# Altium schematic sheet MAINSSMB V1.4 .SchDoc
size A3; SheetNumber: 1; SheetTotal: 1
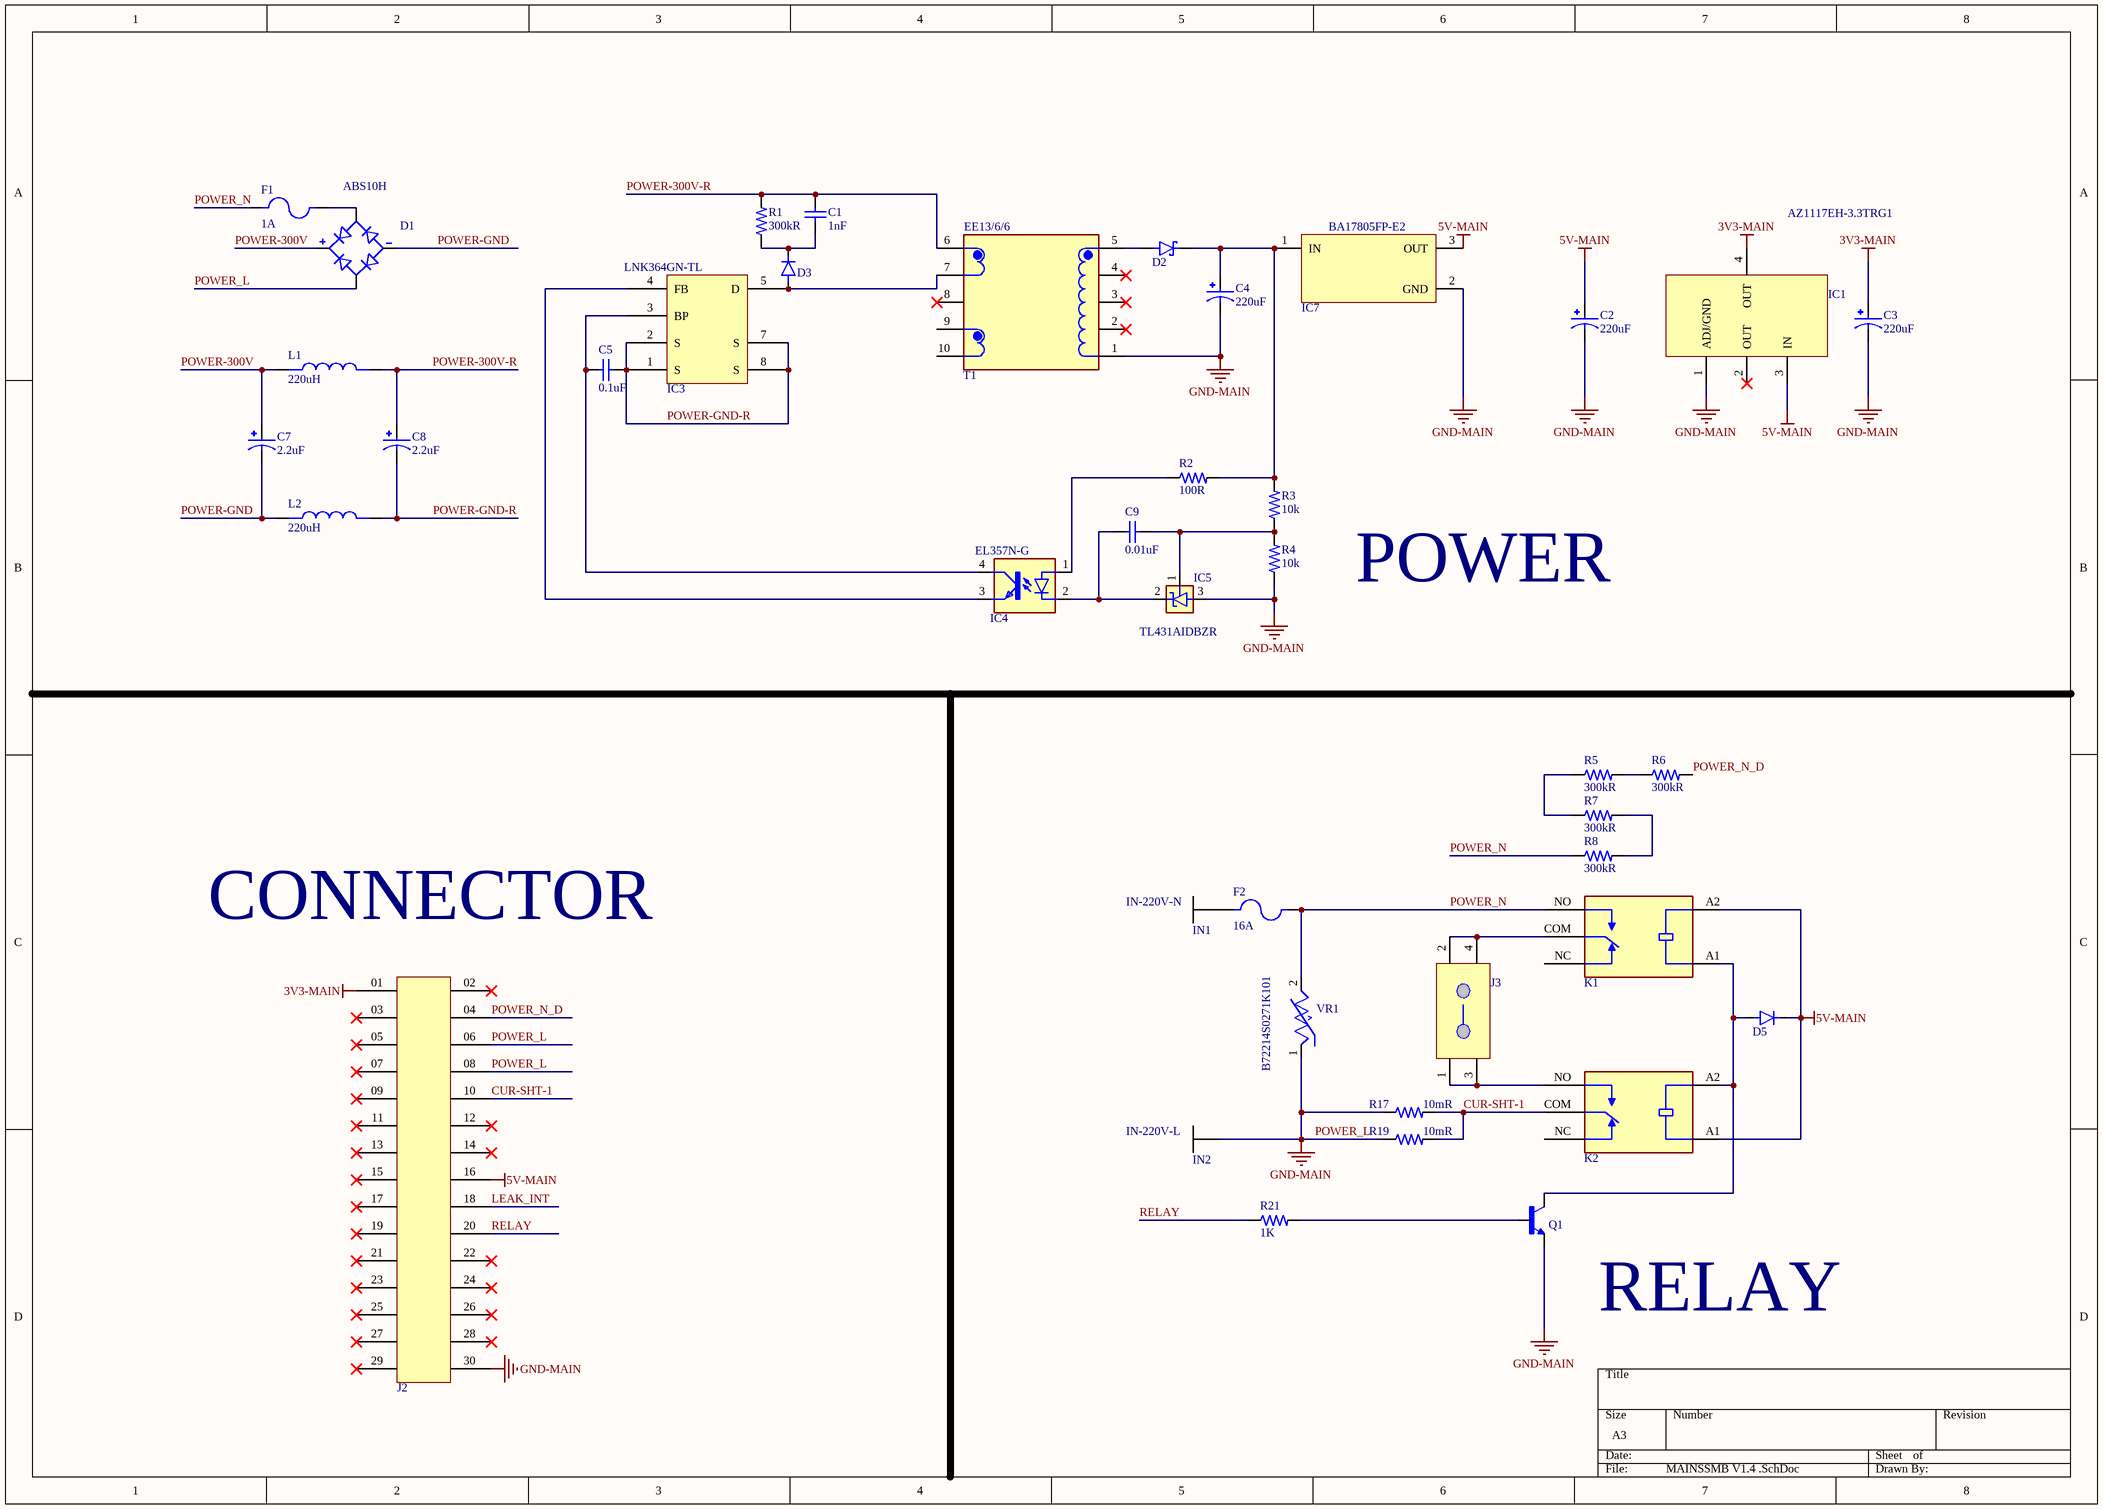
[diagram p0: MAINSSMB V1.4 .SchDoc]

## Parts
C1  value 1nF  [TH-CAP-HxLxW-5.5x4.0x2.5-TDKC]  (hidden comment: 1000 pF ±5% 50V Ceramic Capacitor C0G, NP0 Radial)
C2  value 220uF  [SMD-DxLxW-6.3x6.6x6.6-PEC]  (hidden comment: 220 µF 16 V Aluminum - Polymer Capacitors Radial, Can - SMD 22mOhm 1000 Hrs @ 125°C)
C3  value 220uF  [SMD-DxLxW-6.3x6.6x6.6-PEC]  (hidden comment: 220 µF 10 V Aluminum - Polymer Capacitors Radial, Can - SMD 20mOhm 2000 Hrs @ 105°C)
C4  value 220uF  [SMD-DxLxW-6.3x6.6x6.6-PEC]  (hidden comment: 220 µF 16 V Aluminum - Polymer Capacitors Radial, Can - SMD 22mOhm 1000 Hrs @ 125°C)
C5  value 0.1uF  [SMD-CAP-0603-YAGEO]  (hidden comment: 0.1 µF ±5% 50V Ceramic Capacitor X7R 0603 (1608 Metric))
C7  value 2.2uF  [TH-CAP-HxD-12.5x8.0-PEC]  (hidden comment: 2.2 µF 400 V Aluminum Electrolytic Capacitors Radial, Can 2000 Hrs @ 85°C)
C8  value 2.2uF  [TH-CAP-HxD-12.5x8.0-PEC]  (hidden comment: 2.2 µF 400 V Aluminum Electrolytic Capacitors Radial, Can 2000 Hrs @ 85°C)
C9  value 0.01uF  [SMD-CAP-0603-YAGEO]  (hidden comment: 10000 pF ±5% 25V Ceramic Capacitor X7R 0603 (1608 Metric))
D1  Manufacturer Part Number: ABS10H  [DIODE-SMD-4-TSC]  (hidden comment: Bridge Rectifier Single Phase Standard 1 kV Surface Mount ABS)
D2  Diode 40 V 3A Surface Mount DO-214AC (SMA)  [SMD-DO-214AC-214-CT]  (value not drawn)
D3  Diode 1000 V 1A Surface Mount SOD-123FL  [SOD-123FL-SMCDS]  (value not drawn)
D5  Diode 1000 V 1A Surface Mount SOD-123FL  [SOD-123FL-SMCDS]  (value not drawn)
F1  value 1A  [FUSE-HxLxW-8.0x8.5x4.0-LI]  (hidden comment: 1 A 300 V AC DC Fuse Board Mount (Cartridge Style Excluded) Through Hole Radial, Box)
F2  value 16A  [FUSE-3.6mmx10mm-AXIAL]  (hidden comment: FUSE; 16A; 0031.8211_1)
IC1  MP: AZ1117EH-3.3TRG1  [SOT-223-3-DI]  (hidden comment: Linear Voltage Regulator IC Positive Fixed 1 Output 1A SOT-223-3)
IC3  Converter Offline Flyback Topology 132kHz SMD-8B  [SMD-8B-PI]  (value not drawn)
IC4  Manufacturer Part Number: EL357N-G  [SOP-4]  (hidden comment: Optoisolator Transistor Output 3750Vrms 1 Channel 4-SOP (2.54mm))
IC5  Manufacturer Part Number: TL431AIDBZR  [SOT-23-3-DS]  (hidden comment: Shunt Voltage Reference IC Adjustable 2.495V 36 VV ±1% 100 mA SOT-23-3)
IC7  Manufacturer Part Number: BA17805FP-E2  [TO252-3-RS]  (hidden comment: Linear Voltage Regulator IC Positive Fixed 1 Output 1A TO-252)
IN1  INPUT  [INPUT-2.0x3.5]  (value not drawn)
IN2  INPUT  [INPUT-2.0x3.5]  (value not drawn)
J2  30 Position Elevated Socket Connector 0.100" (2.54mm) Through Hole Gold  [HEADER-2.54-15x2-N3D]  (value not drawn)
J3  Connector Header Through Hole 4 position 0.100" (2.54mm)  [SOCKET-SINGLE-WEV1081H]  (value not drawn)
K1  JQ1P-5V-F  [RELAY-JQ1P-10A-HxLxW-15.6x20.5x10.0-PEW]  (value not drawn)
K2  JQ1P-5V-F  [RELAY-JQ1P-10A-HxLxW-15.6x20.5x10.0-PEW]  (value not drawn)
L1  value 220uH  [SMD-HxLxW-1.8x4.0x4.0-ALLC]  (hidden comment: 220 µH Shielded Drum Core, Wirewound Inductor 250 mA 3.84Ohm Max Nonstandard)
L2  value 220uH  [SMD-HxLxW-1.8x4.0x4.0-ALLC]  (hidden comment: 220 µH Shielded Drum Core, Wirewound Inductor 250 mA 3.84Ohm Max Nonstandard)
Q1  Bipolar (BJT) Transistor NPN 45 V 500 mA 100MHz 300 mW Surface Mount SOT-23-3 (TO-236)  [SOT-23-3-ONSEMI]  (value not drawn)
R1  value 300kR  [SMD-RES-1206-RS]  (hidden comment: 300 kOhms ±1% 0.5W, 1/2W Chip Resistor 1206 (3216 Metric) Automotive AEC-Q200, Pulse Withstanding Thick Film)
R2  value 100R  [SMD-RES-0603-RS]  (hidden comment: 100 Ohms ±1% 0.1W, 1/10W Chip Resistor 0603 (1608 Metric) Automotive AEC-Q200, High Voltage Thick Film)
R3  value 10k  [SMD-RES-0603-SEI]  (hidden comment: 10 kOhms ±1% 0.25W, 1/4W Chip Resistor 0603 (1608 Metric) Automotive AEC-Q200, Pulse Withstanding Thick Film)
R4  value 10k  [SMD-RES-0603-SEI]  (hidden comment: 10 kOhms ±1% 0.25W, 1/4W Chip Resistor 0603 (1608 Metric) Automotive AEC-Q200, Pulse Withstanding Thick Film)
R5  value 300kR  [SMD-RES-0603-RS]  (hidden comment: 300 kOhms ±1% 0.1W, 1/10W Chip Resistor 0603 (1608 Metric) Automotive AEC-Q200, High Voltage Thick Film)
R6  value 300kR  [SMD-RES-0603-RS]  (hidden comment: 300 kOhms ±1% 0.1W, 1/10W Chip Resistor 0603 (1608 Metric) Automotive AEC-Q200, High Voltage Thick Film)
R7  value 300kR  [SMD-RES-0603-RS]  (hidden comment: 300 kOhms ±1% 0.1W, 1/10W Chip Resistor 0603 (1608 Metric) Automotive AEC-Q200, High Voltage Thick Film)
R8  value 300kR  [SMD-RES-0603-RS]  (hidden comment: 300 kOhms ±1% 0.1W, 1/10W Chip Resistor 0603 (1608 Metric) Automotive AEC-Q200, High Voltage Thick Film)
R17  value 10mR  [SMD-RES-2512-VD]  (hidden comment: 10 mOhms ±1% 3W Chip Resistor 2512 (6432 Metric) Automotive AEC-Q200, Current Sense, Moisture Resistant Metal Film)
R19  value 10mR  [SMD-RES-2512-VD]  (hidden comment: 10 mOhms ±1% 3W Chip Resistor 2512 (6432 Metric) Automotive AEC-Q200, Current Sense, Moisture Resistant Metal Film)
R21  value 1K  [SMD-RES-0603-SEI]  (hidden comment: 1 kOhms ±1% 0.25W, 1/4W Chip Resistor 0603 (1608 Metric) Automotive AEC-Q200, Pulse Withstanding Thick Film)
T1  MP: EE13/6/6  [EE13 - POWER]  (hidden comment: For SMPS Transformer 500VAC Isolation Through Hole)
VR1  Manufacturer Part Number: B72214S0271K101  [VARISTOR-TDK]  (hidden comment: VAR; B72214S0271K101)

## Nets
3V3-MAIN: C3.1 IC1.4(OUT) J2.01
5V-MAIN: C2.1 D5.K IC1.3(IN) IC7.3(OUT) J2.16 K1.A2 K2.A1
POWER_L: C2.2 C3.2 C4.2 D1.AC2 IC1.1(ADJ/GND) IC5.3(ANODE) IC7.2(GND) IN2.1(IN) J2.06 J2.08 J2.30 Q1.2(E) R4.1 R17.1 R19.1 T1.1 VR1.1  [also labelled GND-MAIN]
CUR-SHT-1: J2.10 K2.COM R17.2 R19.2
LEAK_INT: J2.18
POWER-300V: C7.1 D1.POS L1.1
POWER-300V-R: C1.2 C8.1 L1.2 R1.2 T1.6
POWER-GND: C7.2 D1.NEG L2.1
POWER-GND-R: C5.2 C8.2 IC3.1(S) IC3.2(S) IC3.7(S) IC3.8(S) L2.2
POWER_N: F1.1 F2.2 K1.NO R8.1 VR1.2
POWER_N_D: J2.04 R6.2
RELAY: J2.20 R21.1
NetC1_1: C1.1 D3.K R1.1
NetC4_1: C4.1 D2.1(K) IC7.1(IN) R2.2 R3.2
NetC5_1: C5.1 IC3.3(BP) IC4.4(COL)
NetC9_1: C9.1 IC4.2(C) IC5.2(CATHODE)
NetC9_2: C9.2 IC5.1(REF) R3.1 R4.2
NetD1_AC1: D1.AC1 F1.2
NetD2_2: D2.2(A) T1.5
NetD3_A: D3.A IC3.5(D) T1.7
NetD5_A: D5.A K1.A1 K2.A2 Q1.3(C)
NetF2_1: F2.1 IN1.1(IN)
NetIC3_4: IC3.4(FB) IC4.3(EMIT)
NetIC4_1: IC4.1(A) R2.1
NetJ3_1: J3.1 J3.3 K2.NO
NetJ3_2: J3.2 J3.4 K1.COM
NetQ1_1: Q1.1(B) R21.2
NetR5_1: R5.1 R7.1
NetR5_2: R5.2 R6.1
NetR7_2: R7.2 R8.2

Not connected (* = marked no-connect by the designer): IC1 2(OUT)*; J2 02* 03* 05* 07* 09* 11* 12* 13* 14* 15* 17* 19* 21* 22* 23* 24* 25* 26* 27* 28* 29*; K1 NC; K2 NC; T1 2* 3* 4* 8* 9 10

## Notes on the sheet
- POWER
- (near IN1) IN-220V-N
- CONNECTOR
- (near IN2) IN-220V-L
- RELAY

## Library data of the parts
C1 = CAP; TH; 0.001uF; 50V; FA28NP01H102JNU06: Capacitor Ceramic 0.001uF 50V C0G 5% 5mm T/R; Manufacturer: TDK; Lead/Base Style: Kinked; Designer: TVBac; Supplier: Digikey; Supplier Part Number: 445-180768-1-ND; Manufacturer Part Number: FA28NP01H102JNU06; Category: Ceramic Capacitors; Stock: 2260; Pricing: 1=0.37, 10=0.22, 50=0.1588, 100=0.1398, 500=0.1073, 1000=0.09719 (USD); Mounting Technology: Through Hole; Case/Package: Radial; Min Operating Temperature: -55°C; Max Operating Temperature: 150°C; Packaging: Tape and Reel; Voltage Rating: 50V; Tolerance: 5%; Features: High Temperature; Series: FA; Length: 0.157inch; Width: 0.098inch; Height - Seated (Max): 0.217inch; Lead Pitch: 0.197inch; Ratings: AEC-Q200; RoHS Compliant: Yes; ComponentLink1URL: https://product.tdk.com/info/en/catalog/datasheets/leadmlcc_halogenfree_fa150_en.pdf?src-supplier=Digikey; ComponentLink1Description: https://product.tdk.com/info/en/catalog/datasheets/leadmlcc_halogenfree_fa150_en.pdf?src-supplier=Digikey; ComponentLink2URL: https://datasheet.octopart.com/FA28NP01H102JNU06-TDK-datasheet-155378142.pdf?src-supplier=TDK; ComponentLink2Description: https://datasheet.octopart.com/FA28NP01H102JNU06-TDK-datasheet-155378142.pdf?src-supplier=TDK; ComponentLink3URL: https://datasheet.octopart.com/FA28NP01H102JNU06-TDK-datasheet-154546129.pdf?src-supplier=Farnell; ComponentLink3Description: https://datasheet.octopart.com/FA28NP01H102JNU06-TDK-datasheet-154546129.pdf?src-supplier=Farnell; ComponentLink4Description: Link Digikey; ComponentLink4URL: https://www.digikey.com/en/products/detail/tdk-corporation/FA28NP01H102JNU06/5866347
C2 C4 = CAP; 220uF; 16V; SMD; 16SVPK220M: Cap Aluminum Polymer 220uF 16VDC 20% (6.3 X 5.9mm) SMD 0.022 Ohm 1040mA 1000h 125C T/R; Manufacturer: Panasonic; Voltage Rating: 16V; ESR (Equivalent Series Resistance): 22mR; Dissipation Factor: 12%; Leakage Current: 704uA; Ripple Current: 3.3A; Designer: TVBac; Supplier: Mouser; Supplier Part Number: 667-16SVPK220M; Manufacturer Part Number: 16SVPK220M; RoHS: Yes; Category: Polymer Capacitors; Stock: 2355; Pricing: 1=1.29, 10=0.794, 50=0.794, 100=0.723, 1000=0.489, 10000=0.45 (USD); Mounting Technology: Surface Mount; Case/Package: Radial; Material: Polymer; Min Operating Temperature: -55°C; Max Operating Temperature: 125°C; Packaging: Cut Tape; Tolerance: 20%; Series: OS-CON™, SVPK; Voltage Rating (DC): 16V; Height: 6mm; ComponentLink1URL: https://industrial.panasonic.com/cdbs/www-data/pdf/AAB8000/AAB8000C226.pdf?src-supplier=Digikey; ComponentLink1Description: https://industrial.panasonic.com/cdbs/www-data/pdf/AAB8000/AAB8000C226.pdf?src-supplier=Digikey; ComponentLink2URL: https://datasheet.octopart.com/16SVPK220M-Panasonic-datasheet-136612383.pdf?src-supplier=Element14; ComponentLink2Description: https://datasheet.octopart.com/16SVPK220M-Panasonic-datasheet-136612383.pdf?src-supplier=Element14; ComponentLink3URL: https://datasheet.octopart.com/16SVPK220M-Panasonic-datasheet-142271499.pdf?src-supplier=Electro+Sonic; ComponentLink3Description: https://datasheet.octopart.com/16SVPK220M-Panasonic-datasheet-142271499.pdf?src-supplier=Electro+Sonic; ComponentLink4URL: https://datasheet.octopart.com/16SVPK220M-Panasonic-datasheet-151949914.pdf?src-supplier=TME; ComponentLink4Description: https://datasheet.octopart.com/16SVPK220M-Panasonic-datasheet-151949914.pdf?src-supplier=TME; ComponentLink5Description: Link Digikey; ComponentLink5URL: https://www.digikey.com/en/products/detail/panasonic-electronic-components/16SVPK220M/9765095
C3 = CAP; 220uF; 10V; SMD; 10SVPE220M: Cap Aluminum Polymer 220uF 10VDC 20%( 6.3 X 5.9mm) SMD 0.02 Ohm 2700mA 2000h 105C T/R; Manufacturer: Panasonic; Voltage Rating: 10V; ESR (Equivalent Series Resistance): 20mR; Ripple Current: 2.7A; Leakage Current: 500uA; Life (Hours): 2000Hour; Dissipation Factor: 12%; Designer: TVBac; Supplier: Mouser; Supplier Part Number: 667-10SVPE220M; Manufacturer Part Number: 10SVPE220M; RoHS: Yes; Category: Polymer Capacitors; Stock: 1969; Pricing: 1=1.66, 10=1.53, 50=1.44, 100=1.19, 1000=0.857, 10000=0.768 (USD); Mounting Technology: Surface Mount; Case/Package: Radial; Pins: 6; Min Operating Temperature: -55°C; Max Operating Temperature: 105°C; Package Quantity: 1000; Packaging: Tape and Reel; Tolerance: 20%; Voltage Rating (DC): 10V; Ripple Current (AC): 2.7A; Termination: SMD/SMT; Voltage: 10V; Series: OS-CON™, SVPE; Construction: Cylindrical; Diameter: 6.3mm; Length: 5.9mm; Height: 5.9mm; Reach SVHC Compliant: No; Lead Free: Lead Free; RoHS Compliant: Yes; ComponentLink1URL: https://datasheet.ciiva.com/25767/1734359-25767468.pdf?src-supplier=Farnell; ComponentLink1Description: https://datasheet.ciiva.com/25767/1734359-25767468.pdf?src-supplier=Farnell; ComponentLink2URL: https://datasheet.ciiva.com/22746/1734359-22746158.pdf?src-supplier=Element14; ComponentLink2Description: https://datasheet.ciiva.com/22746/1734359-22746158.pdf?src-supplier=Element14; ComponentLink3Description: Link Digikey; ComponentLink3URL: https://www.digikey.com/en/products/detail/panasonic-electronic-components/10SVPE220M/4204777
C5 = CAP; 0.1uF; 50V; 0603; SMD; CC0603JRX7R9BB104: Multilayer Ceramic Capacitor, 0.1 uF, 50 V, ï¿½ 5%, X7R, 0603 [1608 Metric]; Manufacturer: Yageo; Material: 4241ConductorMaterial; Designer: TVBac; Supplier: Digikey; Supplier Part Number: 311-1779-1-ND; Manufacturer Part Number: CC0603JRX7R9BB104; RoHS: Yes; Category: Ceramic Capacitors; Stock: 376318; Pricing: 1=0.1, 10=0.07, 50=0.04, 100=0.031, 500=0.02334, 1000=0.01833, 4000=0.01533, 8000=0.014, 12000=0.01333, 28000=0.01267, 100000=0.00917, 200000=0.00887, 400000=0.00833 (USD); Pins: 2NUMBER; Lead Free: 5697LeadFree; Halogen Free: 5694HalogenFree; ComponentLink1URL: https://datasheet.ciiva.com/11465/upy-gphc-x7r-6-3v-to-50v-8-11465038.pdf?src-supplier=Avnet; ComponentLink1Description: https://datasheet.ciiva.com/11465/upy-gphc-x7r-6-3v-to-50v-8-11465038.pdf?src-supplier=Avnet; ComponentLink2Description: Link Digikey; ComponentLink2URL: https://www.digikey.com/en/products/detail/yageo/CC0603JRX7R9BB104/5195188
C7 C8 = CAP; TH; 2.2uF; 400V; ECA-2GM2R2: Cap Aluminum Lytic 2.2uF 400V 20% (8 X 11.5mm) Radial 3.5mm 50mA 2000h 85C Automotive Bulk; Manufacturer: Panasonic; Designer: TVBac; Supplier: Mouser; Supplier Part Number: 667-ECA-2GM2R2; Manufacturer Part Number: ECA-2GM2R2; RoHS: Yes; Category: Aluminum Electrolytic Capacitors; Stock: 1247; Pricing: 1=0.45, 10=0.221, 50=0.221, 100=0.142, 1000=0.119, 10000=0.096 (USD); Pins: 2NUMBER; Lead Free: 5697LeadFree; ComponentLink1URL: https://datasheet.ciiva.com/48522/radial-m-eng-tds-48522426.pdf?src-supplier=Distrelec; ComponentLink1Description: https://datasheet.ciiva.com/48522/radial-m-eng-tds-48522426.pdf?src-supplier=Distrelec; ComponentLink2Description: Link Digikey; ComponentLink2URL: https://www.digikey.com/en/products/detail/panasonic-electronic-components/ECA-2GM2R2/2688912
C9 = CAP; 0.01uF; 25V; 0603; SMD; CC0603JRX7R8BB103: Surface Mount Ceramic Multilayer Capacitor 0.01uF 5% X7R 25V 0603 Paper T/R; Manufacturer: Yageo; Designer: TVBac; Supplier: Digikey; Supplier Part Number: 311-3995-1-ND; Manufacturer Part Number: CC0603JRX7R8BB103; RoHS: Yes; Category: Ceramic Capacitors; Stock: 4379; Pricing: 1=0.1, 10=0.061, 50=0.035, 100=0.0271, 500=0.02036, 1000=0.016 (USD); ComponentLink1URL: https://datasheet.ciiva.com/11465/upy-gphc-x7r-6-3v-to-50v-8-11465030.pdf?src-supplier=Avnet; ComponentLink1Description: https://datasheet.ciiva.com/11465/upy-gphc-x7r-6-3v-to-50v-8-11465030.pdf?src-supplier=Avnet; ComponentLink2Description: Link Digikey; ComponentLink2URL: https://www.digikey.com/en/products/detail/yageo/CC0603JRX7R8BB103/5883656
D1 = DIODE; SMD; ABS10H: Bridge Rectifiers 1A, 1000V, Standard Bridge Rectifier; Manufacturer: Taiwan Semiconductor; Designer: TVBac; Supplier: Digikey; Supplier Part Number: 1801-ABS10HCT-ND; Stock: 4817; Pricing: 1=0.49, 10=0.33, 100=0.2241, 500=0.17496, 1000=0.15869, 2000=0.14481 (USD); ComponentLink1Description: Link Digikey; ComponentLink1URL: https://www.digikey.com/en/products/detail/taiwan-semiconductor-corporation/ABS10H/7366098
D2 = DIODE; SMD; SCHOTTKY; SS34-HF: Diode Schottky Si 40V 3A 2-Pin SMA T/R; Manufacturer: Comchip; Designer: TVBac; Supplier: Digikey; Supplier Part Number: 641-2115-1-ND; Manufacturer Part Number: SS34-HF; RoHS: Yes; Category: LDO; Stock: 65957; Pricing: 1=0.46, 10=0.325, 100=0.164, 500=0.14536, 1000=0.11312, 2000=0.10124 (USD); RoHS Compliant: Yes; ComponentLink1URL: http://www.comchiptech.com/admin/files/product/20190514101641.pdf?src-supplier=Digikey; ComponentLink1Description: http://www.comchiptech.com/admin/files/product/20190514101641.pdf?src-supplier=Digikey; ComponentLink2Description: Link Digikey; ComponentLink2URL: https://www.digikey.com/en/products/detail/comchip-technology/SS34-HF/10279693
D3 D5 = DIODE; SMD; 1N4007FLN4007;: Diode Gen Purp 1KV 1A SOD123FL; Manufacturer: Sangdest Microelectronics; Value: 6pF; Max Forward Surge Current (Ifsm): 30A; Max Reverse Current: 5uA; Designer: TVBac; Supplier: Digikey; Supplier Part Number: 1655-1N4007FLCT-ND; Manufacturer Part Number: 1N4007FL; RoHS: No; Category: Diodes; Stock: 332632; Pricing: 1=0.1, 10=0.058, 100=0.039, 500=0.02954, 1000=0.02627 (USD); Min Operating Temperature: -55°C; Max Operating Temperature: 150°C; Forward Current: 1A; Max Repetitive Reverse Voltage (Vrrm): 1kV; Reverse Voltage: 1kV; Height: 1.1mm; ComponentLink1Description: Link Digikey; ComponentLink1URL: https://www.digikey.com/en/products/detail/smc-diode-solutions/1N4007FL/11657817
F1 = FUSE; 1A; 36911000000: Fuse Subminiature Slow Blow Acting 1A 300V Radial 8.5 X 4 X 8mm Ammo Pack; Manufacturer: Littelfuse Wickmann; DC Cold Resistance: 71.5mR; Blow Characteristic: TIME DELAY; Lead Length: 18.8mm; Designer: TVBac; Supplier: Digikey; Supplier Part Number: F5459CT-ND; Manufacturer Part Number: 36911000000; RoHS: Yes; Category: Fuses; Stock: 1380; Pricing: 1=0.58, 5=0.482, 10=0.446, 50=0.3714, 100=0.3433, 250=0.30924, 500=0.28568, 1400=0.25378, 2800=0.23421, 4200=0.22341, 7000=0.218 (USD); Mounting Technology: Through Hole; Case/Package: Radial; Min Operating Temperature: -40°C; Max Operating Temperature: 85°C; Package Quantity: 1400; Current Rating: 1A; Voltage Rating (AC): 300V; Packaging: Cut Tape; Termination: Radial; Current: 1A; Fuse Current: 1A; Working Voltage: 300V; Fuse Type: Board Mount (Cartridge Style Excluded); Series: TE5® 369; Length: 0.335inch; Width: 0.157inch; Height: 0.315inch; Size: 8mm; Reach SVHC Compliant: No; Lead Free: Lead Free; RoHS Compliant: Yes; ComponentLink1URL: https://datasheet.ciiva.com/7464/littelfuse-fuse-369-series-7464654.pdf?src-supplier=Digikey; ComponentLink1Description: https://datasheet.ciiva.com/7464/littelfuse-fuse-369-series-7464654.pdf?src-supplier=Digikey; ComponentLink2URL: https://datasheet.ciiva.com/16320/littelfuse-fuse-369-16320426.pdf?src-supplier=Future+Electronics; ComponentLink2Description: https://datasheet.ciiva.com/16320/littelfuse-fuse-369-16320426.pdf?src-supplier=Future+Electronics; ComponentLink3Description: Link Digikey; ComponentLink3URL: https://www.digikey.com/en/products/detail/littelfuse-inc/36911000000/1986930
F2 = FUSE; 16A; 0031.8211_1: Manufacturer: Schurter; Designer: TVBac; Supplier: Digikey; Supplier Part Number: 486-1259-ND; Manufacturer Part Number: 0031.8211; RoHS: Yes; Category: Fuse Holders; Stock: 46433; Pricing: 1=0.91, 50=0.676, 100=0.608, 500=0.47 (USD); ComponentLink1URL: https://datasheet.ciiva.com/16215/93typ-ogn-16215101.pdf?src-supplier=Onlinecomponents.com; ComponentLink1Description: https://datasheet.ciiva.com/16215/93typ-ogn-16215101.pdf?src-supplier=Onlinecomponents.com; ComponentLink2URL: https://datasheet.ciiva.com/295/typ-ogn-295737.pdf?src-supplier=Digikey; ComponentLink2Description: https://datasheet.ciiva.com/295/typ-ogn-295737.pdf?src-supplier=Digikey; ComponentLink3URL: https://datasheet.ciiva.com/18416/70160102-18416645.pdf?src-supplier=Allied+Electronics; ComponentLink3Description: https://datasheet.ciiva.com/18416/70160102-18416645.pdf?src-supplier=Allied+Electronics; ComponentLink4URL: https://datasheet.ciiva.com/1269/1842496-1269252.pdf?src-supplier=Element14; ComponentLink4Description: https://datasheet.ciiva.com/1269/1842496-1269252.pdf?src-supplier=Element14; ComponentLink5URL: https://datasheet.ciiva.com/15188/getdatasheetpartid-392105-15188043.pdf?src-supplier=Verical; ComponentLink5Description: https://datasheet.ciiva.com/15188/getdatasheetpartid-392105-15188043.pdf?src-supplier=Verical; ComponentLink6URL: https://datasheet.ciiva.com/16385/typ-ogn-16385398.pdf?src-supplier=Future+Electronics; ComponentLink6Description: https://datasheet.ciiva.com/16385/typ-ogn-16385398.pdf?src-supplier=Future+Electronics; ComponentLink7URL: https://datasheet.ciiva.com/3014/typ-ogn-3014481.pdf?src-supplier=Avnet; ComponentLink7Description: https://datasheet.ciiva.com/3014/typ-ogn-3014481.pdf?src-supplier=Avnet
IC1 = LDO; 3V3; 1A; SMD; AZ1117EH-3.3TRG1: Linear Voltage Regulator IC 1 Output 1A SOT-223; MF: Diodes Inc.; Designer: TVBac; Package: SOT-223 Diodes Inc.; Value: *; Price: None; SnapEDA_Link: https://www.snapeda.com/parts/AZ1117EH-3.3TRG1/Diodes%20Inc./view-part/482930/?ref=snap; Availability: Unavailable; ComponentLink1Description: Link Digikey; ComponentLink1URL: https://www.digikey.com/en/products/detail/diodes-incorporated/AZ1117EH-3-3TRG1/5001329
IC3 = LNK364GN-TL: AC to DC Switching Converter Off-Line Switcher 140kHz 7-Pin SMD-B / IC OFFLINE SWIT HV 8SMD; Manufacturer: Power Integrations; Designer: TVBac; Supplier: Digikey; Supplier Part Number: 596-1089-1-ND; Manufacturer Part Number: LNK364GN-TL; RoHS: Yes; Category: Voltage Regulators - Switching; Stock: 726; Pricing: 1=0.87, 100=0.7168 (USD); ComponentLink1URL: https://datasheet.ciiva.com/1930/lnk362-364-1930587.pdf?src-supplier=Digikey; ComponentLink1Description: https://datasheet.ciiva.com/1930/lnk362-364-1930587.pdf?src-supplier=Digikey; ComponentLink2URL: https://datasheet.ciiva.com/1930/lnk362-364-1930588.pdf?src-supplier=Digikey; ComponentLink2Description: https://datasheet.ciiva.com/1930/lnk362-364-1930588.pdf?src-supplier=Digikey; ComponentLink3URL: https://datasheet.ciiva.com/1930/lnk362-364-1930589.pdf?src-supplier=Digikey; ComponentLink3Description: https://datasheet.ciiva.com/1930/lnk362-364-1930589.pdf?src-supplier=Digikey; ComponentLink4URL: https://datasheet.ciiva.com/12230/lnk362-364-3310-12230262.pdf?src-supplier=Mouser; ComponentLink4Description: https://datasheet.ciiva.com/12230/lnk362-364-3310-12230262.pdf?src-supplier=Mouser; ComponentLink5Description: Link Digikey; ComponentLink5URL: https://www.digikey.com/en/products/detail/power-integrations/LNK364GN-TL/1007182
IC4 = ISO; 1CH; EL357N-G: Transistor Output Optocoupler, 1-Element, 3750V Isolation; Manufacturer: Everlight; Supplier: Digikey; Supplier Part Number: 1080-1037-ND; RoHS: Yes; Category: Optocouplers; Stock: 137; Pricing: 1=0.7, 10=0.416, 100=0.2729, 500=0.2168, 1000=0.19958, 2000=0.18548, 5000=0.17066, 10000=0.16177, 25000=0.15242 (USD); ComponentLink1URL: https://datasheet.ciiva.com/2086/201407061738295695-2086633.pdf?src-supplier=Digikey; ComponentLink1Description: https://datasheet.ciiva.com/2086/201407061738295695-2086633.pdf?src-supplier=Digikey
IC5 = TL431AIDBZR; MIRROID;: V-Ref Adjustable 2.495V to 36V 100mA Automotive 3-Pin SOT-23 T/R; Manufacturer: Texas Instruments; Max Supply Voltage: 37V; Number of Channels: 1; Temperature Coefficient: 92ppm/°C; Cathode Current: 700uA; Reference Type: Shunt,Adjustable; Designer: TVBac; Supplier: Mouser; Supplier Part Number: 595-TL431AIDBZR; RoHS: Yes; Category: Voltage References; Stock: 734349; Pricing: 1=0.25, 10=0.142, 50=0.142, 100=0.101, 1000=0.095, 10000=0.08 (USD); Case/Package: SOT-23; Pins: 3; Min Operating Temperature: -40°C; Max Operating Temperature: 125°C; Min Input Voltage: 2.495V; Packaging: Tape and Reel; Output Voltage: 36V; Package Quantity: 1; Tolerance: 1%; Max Output current: 100mA; Output Current: 100mA; Min Output Voltage: 2.495V; Max Output Voltage: 36V; Reference Voltage: 36V; Series: -; Output Type: Adjustable; Radiation Hardening: No; Reach SVHC Compliant: No; Lead Free: Lead Free; RoHS Compliant: Yes; ComponentLink1URL: https://datasheet.ciiva.com/3235/tl432b-3235600.pdf?src-supplier=Avnet; ComponentLink1Description: https://datasheet.ciiva.com/3235/tl432b-3235600.pdf?src-supplier=Avnet; ComponentLink2URL: https://datasheet.ciiva.com/15148/getdatasheetpartid-171576-15148968.pdf?src-supplier=Verical; ComponentLink2Description: https://datasheet.ciiva.com/15148/getdatasheetpartid-171576-15148968.pdf?src-supplier=Verical; ComponentLink3URL: https://datasheet.ciiva.com/41462/001014548-da-01-en-ic-vref-shunt-prec-tl431aidbzr-sot-3-tid-41462400.pdf?src-supplier=Conrad; ComponentLink3Description: https://datasheet.ciiva.com/41462/001014548-da-01-en-ic-vref-shunt-prec-tl431aidbzr-sot-3-tid-41462400.pdf?src-supplier=Conrad; ComponentLink4URL: https://datasheet.ciiva.com/46397/1887475-46397705.pdf?src-supplier=Element14; ComponentLink4Description: https://datasheet.ciiva.com/46397/1887475-46397705.pdf?src-supplier=Element14; ComponentLink5URL: https://datasheet.ciiva.com/2006/tl431a-2006188.pdf?src-supplier=Digikey; ComponentLink5Description: https://datasheet.ciiva.com/2006/tl431a-2006188.pdf?src-supplier=Digikey; ComponentLink6URL: https://datasheet.ciiva.com/2006/tl431a-2006187.pdf?src-supplier=Digikey; ComponentLink6Description: https://datasheet.ciiva.com/2006/tl431a-2006187.pdf?src-supplier=Digikey; ComponentLink7URL: https://datasheet.ciiva.com/2006/tl431a-2006189.pdf?src-supplier=Digikey; ComponentLink7Description: https://datasheet.ciiva.com/2006/tl431a-2006189.pdf?src-supplier=Digikey; ComponentLink8Description: Link Digikey; ComponentLink8URL: https://www.digikey.com/en/products/detail/texas-instruments/TL431AIDBZR/686856
IC7 = LDO; 5V; 1A; BA17805FP-E2: Linear Voltage Regulator, Fixed, Positive Output, 7.5 V to 25 V, 5V, 1A, 3 Pins, TO-252 (DPAK); Manufacturer: Rohm; Number of Channels: 1NUMBER; Watchdog Timer: 5511WatchdogTimer; Designer: TVBac; Supplier: Mouser; Supplier Part Number: 755-BA17805FP-E2; RoHS: Yes; Category: Voltage Regulators - Linear; Stock: 4846; Pricing: 1=0.82, 10=0.599, 50=0.599, 100=0.411, 1000=0.336, 10000=0.251 (USD); Lead Free: 5697LeadFree; ComponentLink1URL: https://datasheet.ciiva.com/23912/1747296-23912291.pdf?src-supplier=Newark; ComponentLink1Description: https://datasheet.ciiva.com/23912/1747296-23912291.pdf?src-supplier=Newark; ComponentLink2URL: https://datasheet.ciiva.com/26878/getdatasheetpartid-477305-26878653.pdf?src-supplier=Verical; ComponentLink2Description: https://datasheet.ciiva.com/26878/getdatasheetpartid-477305-26878653.pdf?src-supplier=Verical; ComponentLink3URL: https://datasheet.ciiva.com/22732/1747296-22732780.pdf?src-supplier=Element14; ComponentLink3Description: https://datasheet.ciiva.com/22732/1747296-22732780.pdf?src-supplier=Element14; ComponentLink4URL: https://datasheet.ciiva.com/6594/ba178-series-j-6594060.pdf?src-supplier=Digikey; ComponentLink4Description: https://datasheet.ciiva.com/6594/ba178-series-j-6594060.pdf?src-supplier=Digikey; ComponentLink5URL: https://datasheet.ciiva.com/6594/ba178-series-j-6594061.pdf?src-supplier=Digikey; ComponentLink5Description: https://datasheet.ciiva.com/6594/ba178-series-j-6594061.pdf?src-supplier=Digikey; ComponentLink6URL: https://datasheet.ciiva.com/6594/ba178-series-j-6594062.pdf?src-supplier=Digikey; ComponentLink6Description: https://datasheet.ciiva.com/6594/ba178-series-j-6594062.pdf?src-supplier=Digikey; ComponentLink7Description: Link Digikey; ComponentLink7URL: https://www.digikey.com/en/products/detail/rohm-semiconductor/BA17805FP-E2/658261
IN1 IN2 = INPUT-2.0x3.5: Designer: TVBac
J2 = HEADER; 15x2PIN; 2.54; VER; ESQ-115-12-G-D; N3D: Connector Receptacle 30 Position 0.100" (2.54mm) Gold Through Hole; Manufacturer: Samtec; Number of Positions: 30; Pitch: 0.1inch; Designer: TVBac; Supplier: Avnet; Supplier Part Number: ESQ-115-12-G-D; Manufacturer Part Number: ESQ-115-12-G-D; RoHS: Yes; Category: Connectors; Stock: 311; Pricing: 1=6.2034, 10=5.5341, 30=5.50572, 50=5.47734, 100=4.4064 (USD); Mounting Technology: Through Hole; Contact Plating: Gold; Contact Material: Bronze; Color: Black; Number of Rows: 2; Packaging: Rail/Tube; Package Quantity: 1; Connector Type: Receptacle; Termination: Solder; Number of Contacts: 30; Gender: Receptacle; Series: ESQ; Contact Type: Female Socket; Row Spacing: 0.1inch; Reach SVHC Compliant: No; RoHS Compliant: Yes; ComponentLink1URL: https://datasheet.ciiva.com/755/esq-1xx-xx-x-x-xxx-xx-x-xx-mkt-755974.pdf?src-supplier=Digikey; ComponentLink1Description: https://datasheet.ciiva.com/755/esq-1xx-xx-x-x-xxx-xx-x-xx-mkt-755974.pdf?src-supplier=Digikey; System: Connector; ComponentLink2Description: Link Digikey; ComponentLink2URL: https://www.digikey.com/en/products/detail/samtec-inc/ESQ-115-12-G-D/2640973
J3 = SOCKET; SINGLE;: Conn Unshrouded Header HDR 4 POS 2.54mm Solder ST Thru-Hole Automotive Bulk; Manufacturer: Samtec; Manufacturer Part Number: TSW-104-14-L-S; Designer: TVBac; Supplier: Digikey; Supplier Part Number: SAM1055-04-ND; RoHS: Yes; Category: Connectors; Stock: 1246; Pricing: 1=0.43, 10=0.377, 100=0.3107, 500=0.2702, 1000=0.22291, 5000=0.19589, 10000=0.18238 (USD); ComponentLink1URL: https://datasheet.ciiva.com/25618/0900766b81154476-25618487.pdf?src-supplier=Rs; ComponentLink1Description: https://datasheet.ciiva.com/25618/0900766b81154476-25618487.pdf?src-supplier=Rs; ComponentLink2URL: https://datasheet.ciiva.com/10190/htsw-th-10190703.pdf?src-supplier=Avnet; ComponentLink2Description: https://datasheet.ciiva.com/10190/htsw-th-10190703.pdf?src-supplier=Avnet; ComponentLink3Description: Link Digikey; ComponentLink3URL: https://www.digikey.com/en/products/detail/samtec-inc/TSW-104-14-L-S/1102620
K1 K2 = RELAY; SINGLE; 5VDC; CMP-05607-000163-1: RELAY GEN PURPOSE SPDT 10A 5V; Relay Type: General Purpose; Coil Current: 80mA; Power Rating: 400mW; Operate Time: 20ms; Coil Resistance: 62.5R; Release Time: 10ms; Voltage Rating (AC): 250V; Max Voltage Rating (DC): 110V; Coil Type: Non-Latching; Designer: TVBac; Height: 15.6mm; Mount: Through Hole; Coil Voltage (DC): 5V; Package Quantity: 100; Width: 20mm; Lead Free: Lead Free; Throw Configuration: SPDT; Max Operating Temperature: 70°C; Contact Current Rating: 10A; Termination: PC Pin; Series: JQ; Length: 20mm; Contact Material: Tin; Weight: 7g; RoHS Compliant: Yes; Number of Pins: 5; Depth: 10mm; Packaging: Bulk; Coil Power: 400mW; Max Voltage Rating (AC): 250V; Power Consumption: 400mW; Min Operating Temperature: -40°C; ComponentLink1Description: Link Digikey; ComponentLink1URL: https://www.digikey.com/en/products/detail/panasonic-electric-works/JQ1P-5V-F/1242024?s=N4IgTCBcDaIFIEUCMAFAtAVgGpoGIgF0BfIA
L1 L2 = IND; 220uH; 250mA; ASPI-0418FS-221M-T3: Power Inductor (SMD), 220 uH, ± 20%, 250 mA, Shielded, 330 mA, 4mm x 4mm x 1.8mm; Manufacturer: Abracon; Designer: TVBac; Supplier: Mouser; Supplier Part Number: 815-ASPI0418FS221MT3; Manufacturer Part Number: ASPI-0418FS-221M-T3; RoHS: No; Category: Fixed Inductors; Stock: 2874; Pricing: 1=0.36, 10=0.234, 50=0.234, 100=0.182, 1000=0.163, 10000=0.127 (USD); ComponentLink1URL: https://abracon.com/Magnetics/new/ASPI-0418FS.pdf?src-supplier=Digikey; ComponentLink1Description: https://abracon.com/Magnetics/new/ASPI-0418FS.pdf?src-supplier=Digikey; ComponentLink2Description: Link Digikey; ComponentLink2URL: https://www.digikey.com/en/products/detail/abracon-llc/ASPI-0418FS-221M-T3/10273501
Q1 = TRAN; NPN; 500mA;V;  BC817-25LT1G: Single Bipolar Transistor, NPN, 45 V, 500 mA, 225 mW, SOT-23 (TO-236), 3 Pins, Surface Mount; Manufacturer: ON Semiconductor; Max Power Dissipation: 300mW; hFE Min: 160; Max Collector Current: 500mA; Collector Emitter Breakdown Voltage: 45V; Collector Base Voltage (VCBO): 50V; Collector-emitter Voltage-Max: 700mV; Number of Elements: 1; Emitter Base Voltage (VEBO): 5V; Designer: TVBac; Supplier: Future Electronics; Supplier Part Number: 8062284; Manufacturer Part Number: BC817-25LT1G; RoHS: Yes; Category: BJTs; Stock: 1185000; Pricing: 3000=0.0157, 12000=0.0151, 30000=0.0146, 75000=0.0142, 120000=0.0136 (USD); Case/Package: SOT-23-3; Pins: 3; Contact Plating: Tin,Matte; Min Operating Temperature: -55°C; Max Operating Temperature: 150°C; Package Quantity: 3000; Packaging: Tape and Reel; Transition Frequency: 100MHz; Polarity: NPN; Max Breakdown Voltage: 45V; Power Dissipation: 300mW; Clock Frequency: 100MHz; Series: -; Frequency: 100MHz; Collector Emitter Voltage (VCEO): 45V; Collector Emitter Saturation Voltage: 700mV; Gain Bandwidth Product: 100MHz; Current Rating: 500mA; Length: 2.9mm; Width: 1.3mm; Height: 0.94mm; Radiation Hardening: No; Lead Free: Lead Free; RoHS Compliant: Yes; Reach SVHC Compliant: No; ComponentLink1URL: https://datasheet.ciiva.com/27748/2010413-27748829.pdf?src-supplier=Jameco; ComponentLink1Description: https://datasheet.ciiva.com/27748/2010413-27748829.pdf?src-supplier=Jameco; ComponentLink2URL: https://datasheet.ciiva.com/1196/bc817-16lt1-d-1196558.pdf?src-supplier=Element14; ComponentLink2Description: https://datasheet.ciiva.com/1196/bc817-16lt1-d-1196558.pdf?src-supplier=Element14; ComponentLink3URL: https://datasheet.ciiva.com/22641/bc817-16lt1-d-22641013.pdf?src-supplier=Farnell; ComponentLink3Description: https://datasheet.ciiva.com/22641/bc817-16lt1-d-22641013.pdf?src-supplier=Farnell; ComponentLink4URL: https://datasheet.ciiva.com/22664/bc817-16lt1-d-22664204.pdf?src-supplier=Element14; ComponentLink4Description: https://datasheet.ciiva.com/22664/bc817-16lt1-d-22664204.pdf?src-supplier=Element14; ComponentLink5URL: https://datasheet.ciiva.com/22664/1842041-22664101.pdf?src-supplier=Element14; ComponentLink5Description: https://datasheet.ciiva.com/22664/1842041-22664101.pdf?src-supplier=Element14; ComponentLink6Description: Link Digikey; ComponentLink6URL: https://www.digikey.com/en/products/detail/onsemi/BC817-25LT1G/918339
R1 = RES; 300K; 1206; ESR18EZPF3003: Res Thick Film 1206 300K Ohm 1% 0.5W(1/2W) ±100ppm/C Epoxy Resin Pad SMD Automotive T/R; Manufacturer: Rohm; Max Power Dissipation: 500mW; Temperature Coefficient: 100ppm/°C; Voltage Rating: 200V; Designer: TVBac; Supplier: Mouser; Supplier Part Number: 755-ESR18EZPF3003; Manufacturer Part Number: ESR18EZPF3003; RoHS: Yes; Category: Chip SMD Resistors; Stock: 34367; Pricing: 1=0.12, 10=0.042, 50=0.042, 100=0.026, 1000=0.023, 10000=0.016 (USD); Case/Package: 1206; Case Code (Metric): 3216; Case Code (Imperial): 1206; Min Operating Temperature: -55°C; Max Operating Temperature: 155°C; Tolerance: 1%; Packaging: Cut Tape; Number of Terminations: 2; Features: Automotive AEC-Q200; Series: ESR; Ratings: AEC-Q200; RoHS Compliant: Yes; ComponentLink1URL: https://datasheet.ciiva.com/2527/esr-2527195.pdf?src-supplier=Digikey; ComponentLink1Description: https://datasheet.ciiva.com/2527/esr-2527195.pdf?src-supplier=Digikey; ComponentLink2URL: https://datasheet.ciiva.com/2527/esr-2527196.pdf?src-supplier=Digikey; ComponentLink2Description: https://datasheet.ciiva.com/2527/esr-2527196.pdf?src-supplier=Digikey; ComponentLink3URL: https://datasheet.ciiva.com/2527/esr-2527197.pdf?src-supplier=Digikey; ComponentLink3Description: https://datasheet.ciiva.com/2527/esr-2527197.pdf?src-supplier=Digikey; ComponentLink4Description: Link Digikey; ComponentLink4URL: https://www.digikey.com/en/products/detail/rohm-semiconductor/ESR18EZPF3003/1983605
R2 = RES; 100R; 0603; SMD; KTR03EZPF1000: Res Thick Film 0603 100 Ohm 1% 0.1W(1/10W) ±100ppm/C Pad SMD T/R Automotive AEC-Q200; Manufacturer: Rohm; Max Power Dissipation: 100mW; Temperature Coefficient: 100ppm/°C; Voltage Rating: 350V; Designer: TVBac; Supplier: Mouser; Supplier Part Number: 755-KTR03EZPF1000; Manufacturer Part Number: KTR03EZPF1000; RoHS: Yes; Category: Chip SMD Resistors; Stock: 66325; Pricing: 1=0.12, 10=0.039, 50=0.039, 100=0.024, 1000=0.021, 10000=0.015 (USD); Case/Package: 0603; Case Code (Metric): 1608; Case Code (Imperial): 0603; Min Operating Temperature: -55°C; Max Operating Temperature: 155°C; Packaging: Cut Tape; Tolerance: 1%; Number of Terminations: 2; Features: Automotive AEC-Q200; Series: KTR; Voltage Rating (DC): 350V; Ratings: AEC-Q200; RoHS Compliant: Yes; ComponentLink1URL: https://datasheet.ciiva.com/14926/ktr-14926472.pdf?src-supplier=Digikey; ComponentLink1Description: https://datasheet.ciiva.com/14926/ktr-14926472.pdf?src-supplier=Digikey; ComponentLink2URL: https://datasheet.ciiva.com/14932/ktr-14932133.pdf?src-supplier=Digikey; ComponentLink2Description: https://datasheet.ciiva.com/14932/ktr-14932133.pdf?src-supplier=Digikey; ComponentLink3Description: Link Digikey; ComponentLink3URL: https://www.digikey.com/en/products/detail/rohm-semiconductor/KTR03EZPF1000/4051558
R3 R4 = RES; 10K; 0603; SMD; ESR03EZPF1002: SMD Chip Resistor, 10 kOhm, ± 1%, 250 mW, 0603 [1608 Metric], Thick Film, Anti-Surge; Manufacturer: Rohm; Power Rating: 250mW; Temperature Coefficient: 100ppm/°C; Voltage Rating (DC): 150V; Designer: TVBac; Supplier: Digikey; Supplier Part Number: RHM10KADCT-ND; Manufacturer Part Number: ESR03EZPF1002; RoHS: Yes; Category: Chip SMD Resistors; Stock: 2136779; Pricing: 1=0.16, 10=0.078, 50=0.0516, 100=0.044, 500=0.03138, 1000=0.02764 (USD); Case/Package: 0603; Case Code (Metric): 1608; Case Code (Imperial): 0603; Min Operating Temperature: -55°C; Max Operating Temperature: 155°C; Tolerance: 1%; Package Quantity: 1; Packaging: Cut Tape; Number of Terminations: 2; Max Power Dissipation: 250mW; Features: Automotive AEC-Q200; Series: ESR; Length: 0.063inch; Width: 0.031inch; Height: 0.022inch; Ratings: AEC-Q200; RoHS Compliant: Yes; Lead Free: 5697LeadFree; ComponentLink1URL: https://datasheet.ciiva.com/2469/esr-2469710.pdf?src-supplier=Digikey; ComponentLink1Description: https://datasheet.ciiva.com/2469/esr-2469710.pdf?src-supplier=Digikey; ComponentLink2URL: https://datasheet.ciiva.com/2469/esr-2469711.pdf?src-supplier=Digikey; ComponentLink2Description: https://datasheet.ciiva.com/2469/esr-2469711.pdf?src-supplier=Digikey; ComponentLink3URL: https://datasheet.ciiva.com/2469/esr-2469709.pdf?src-supplier=Digikey; ComponentLink3Description: https://datasheet.ciiva.com/2469/esr-2469709.pdf?src-supplier=Digikey; ComponentLink4Description: Link Digikey; ComponentLink4URL: https://www.digikey.com/en/products/detail/rohm-semiconductor/ESR03EZPF1002/1983429
R5-R8 = RES; 300K; 0603; SMD; KTR03EZPF3003: Res High Voltage Thick Film 0603 300k Ohm 1% 1/10W ±100ppm/°C Molded Paper T/R; Manufacturer: Rohm; Max Power Dissipation: 100mW; Voltage Rating: 350V; Designer: TVBac; Supplier: Mouser; Supplier Part Number: 755-KTR03EZPF3003; Manufacturer Part Number: KTR03EZPF3003; RoHS: Yes; Category: Chip SMD Resistors; Stock: 9502; Pricing: 1=0.17, 10=0.055, 50=0.055, 100=0.032, 1000=0.026, 10000=0.019 (USD); Case/Package: 0603; Case Code (Metric): 1608; Case Code (Imperial): 0603; Min Operating Temperature: -55°C; Max Operating Temperature: 155°C; Package Quantity: 5000; Packaging: Cut Tape; Tolerance: 1%; Number of Terminations: 2; Temperature Coefficient: 100ppm/°C; Features: Automotive AEC-Q200; Series: KTR; Voltage Rating (DC): 350V; Length: 0.063inch; Width: 0.031inch; Height: 0.022inch; RoHS Compliant: Yes; ComponentLink1URL: https://datasheet.ciiva.com/14926/ktr-14926439.pdf?src-supplier=Digikey; ComponentLink1Description: https://datasheet.ciiva.com/14926/ktr-14926439.pdf?src-supplier=Digikey; ComponentLink2URL: https://datasheet.ciiva.com/14925/ktr-14925709.pdf?src-supplier=Digikey; ComponentLink2Description: https://datasheet.ciiva.com/14925/ktr-14925709.pdf?src-supplier=Digikey; ComponentLink3Description: Link Digikey; ComponentLink3URL: https://www.digikey.com/en/products/detail/rohm-semiconductor/KTR03EZPF3003/4051625
R17 R19 = RES; SHUNT; 10mOhm; SMD; WFMA2512R0100FEA: Res Current Sense Metal Plate 2512 0.01 Ohm 1% 3W ±110ppm/°C Molded T/R; Manufacturer: Vishay; Designer: TVBac; Supplier: Digikey; Supplier Part Number: 541-10292-6-ND; Manufacturer Part Number: WFMA2512R0100FEA; RoHS: Yes; Category: Chip SMD Resistors; Pricing: 1=2.85, 10=1.682, 25=1.3844, 50=1.2026, 100=1.0506, 250=0.88712, 500=0.78654, 1000=0.70625 (USD); Power Rating: 3W; Temperature Coefficient: 110ppm/°C; ComponentLink1URL: http://www.vishay.com/docs/30387/wfm.pdf?src-supplier=Digikey; ComponentLink1Description: http://www.vishay.com/docs/30387/wfm.pdf?src-supplier=Digikey; ComponentLink2URL: http://www.farnell.com/datasheets/2793367.pdf?src-supplier=Newark; ComponentLink2Description: http://www.farnell.com/datasheets/2793367.pdf?src-supplier=Newark; ComponentLink3Description: Link Digikey; ComponentLink3URL: https://www.digikey.com/en/products/detail/vishay-dale/WFMA2512R0100FEA/9992531; ComponentLink4Description: Link CXT; ComponentLink4URL: https://linhkien.cxt.vn/3121-wfma2512r0100fea-tro-001-ohms-1-3w.html
R21 = RES; 1K; 0603; SMD; ESR03EZPF1001: SMD Chip Resistor, 1 kOhm, ± 1%, 250 mW, 0603 [1608 Metric], Thick Film, Anti-Surge; Manufacturer: Rohm; Voltage Rating: 150V; Designer: TVBac; Supplier: Digikey; Supplier Part Number: RHM1.00KADCT-ND; Manufacturer Part Number: ESR03EZPF1001; RoHS: Yes; Category: Chip SMD Resistors; Stock: 2703233; Pricing: 1=0.11, 10=0.055, 50=0.0364, 100=0.0309, 500=0.02206, 1000=0.01943 (USD); Voltage Rating (DC): 150V; Lead Free: 5697LeadFree; ComponentLink1URL: https://datasheet.ciiva.com/2469/esr-2469712.pdf?src-supplier=Digikey; ComponentLink1Description: https://datasheet.ciiva.com/2469/esr-2469712.pdf?src-supplier=Digikey; ComponentLink2URL: https://datasheet.ciiva.com/2469/esr-2469713.pdf?src-supplier=Digikey; ComponentLink2Description: https://datasheet.ciiva.com/2469/esr-2469713.pdf?src-supplier=Digikey; ComponentLink3URL: https://datasheet.ciiva.com/2469/esr-2469714.pdf?src-supplier=Digikey; ComponentLink3Description: https://datasheet.ciiva.com/2469/esr-2469714.pdf?src-supplier=Digikey; ComponentLink4Description: Link Digikey; ComponentLink4URL: https://www.digikey.com/en/products/detail/rohm-semiconductor/ESR03EZPF1001/1983428
T1 = EE13/6/6-Power: OFFLINE TRANSFORMER 6W EE13/7/6; MF: Wurth Electronics Inc; SnapEDA_Link: https://www.snapeda.com/parts/EE13/6/6/Wurth+Electronics/view-part/?ref=snap; Package: Package; Value: *; Check_prices: https://www.snapeda.com/parts/EE13/6/6/Wurth+Electronics/view-part/?ref=eda
VR1 = VAR; B72214S0271K101: Var MOV 275VAC/350VDC 4500A 430V Thru-Hole Radial Automotive Bulk; Manufacturer: TDK EPCOS; Supplier: Digikey; Supplier Part Number: 495-1412-ND; RoHS: Yes; Category: Varistors; Stock: 42424; Pricing: 1=0.76, 10=0.46, 25=0.3804, 100=0.2902, 250=0.24588, 500=0.21856, 1000=0.19569, 2500=0.17105, 5000=0.15589 (USD); ComponentLink1URL: https://datasheet.ciiva.com/11834/0900766b80188ddb-11834422.pdf?src-supplier=Rs; ComponentLink1Description: https://datasheet.ciiva.com/11834/0900766b80188ddb-11834422.pdf?src-supplier=Rs; ComponentLink2URL: https://datasheet.ciiva.com/4540/siov-leaded-standard-4540892.pdf?src-supplier=Mouser; ComponentLink2Description: https://datasheet.ciiva.com/4540/siov-leaded-standard-4540892.pdf?src-supplier=Mouser; ComponentLink3URL: https://datasheet.ciiva.com/1278/1899727-1278041.pdf?src-supplier=Element14; ComponentLink3Description: https://datasheet.ciiva.com/1278/1899727-1278041.pdf?src-supplier=Element14